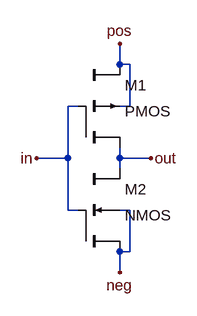
[diagram p0: schematic inverter.asc]
inverter.asc, the LTspice schematic file:
Version 4
SHEET 1 880 680
WIRE 240 48 240 16
WIRE 256 48 240 48
WIRE 176 112 160 112
WIRE 256 112 256 48
WIRE 256 112 240 112
WIRE 160 192 160 112
WIRE 160 192 112 192
WIRE 240 192 240 176
WIRE 288 192 240 192
WIRE 240 208 240 192
WIRE 160 272 160 192
WIRE 176 272 160 272
WIRE 256 272 240 272
WIRE 256 336 256 272
WIRE 256 336 240 336
WIRE 240 368 240 336
FLAG 112 192 in
FLAG 288 192 out
FLAG 240 16 pos
FLAG 240 368 neg
SYMBOL cktsym\\pmos4 240 112 R0
SYMATTR InstName M1
SYMATTR Value2 l=0.6u w=4.2u
SYMBOL cktsym\\nmos4 240 272 R0
SYMATTR InstName M2
SYMATTR Value2 l=0.6u w=3u

The netlist it stands for:
* inverter.asc
M1 out in pos pos PMOS l=0.6u w=4.2u
M2 out in neg neg NMOS l=0.6u w=3u
.model NMOS NMOS
.model PMOS PMOS
.lib standard.mos
.backanno
.end